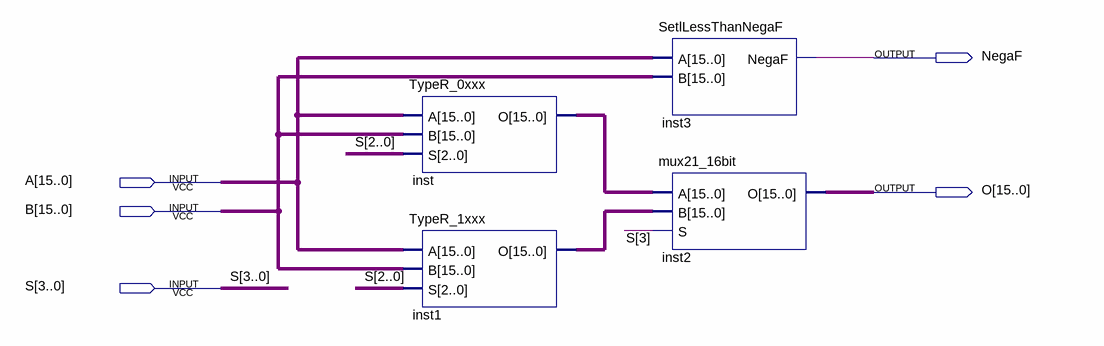
[diagram p0: schematic sheet]
// Quartus schematic ALU_TypeR.bdf as structural Verilog: 4 symbols, 5 pins
module ALU_TypeR (
  input  [15:0] A,
  input  [15:0] B,
  input  [3:0] S,
  output NegaF,
  output [15:0] O
);

  wire [15:0] inst1_o, inst_o;

  TypeR_0xxx inst (.A(A), .B(B), .S(S[2:0]), .O(inst_o));
  TypeR_1xxx inst1 (.A(A), .B(B), .S(S[2:0]), .O(inst1_o));
  SetlLessThanNegaF inst3 (.A(A), .B(B), .NegaF(NegaF));
  mux21_16bit inst2 (.A(inst_o), .B(inst1_o), .S(S[3]), .O(O));
endmodule
